# EAGLE schematic ControlModule (EAGLE 9.1.3)
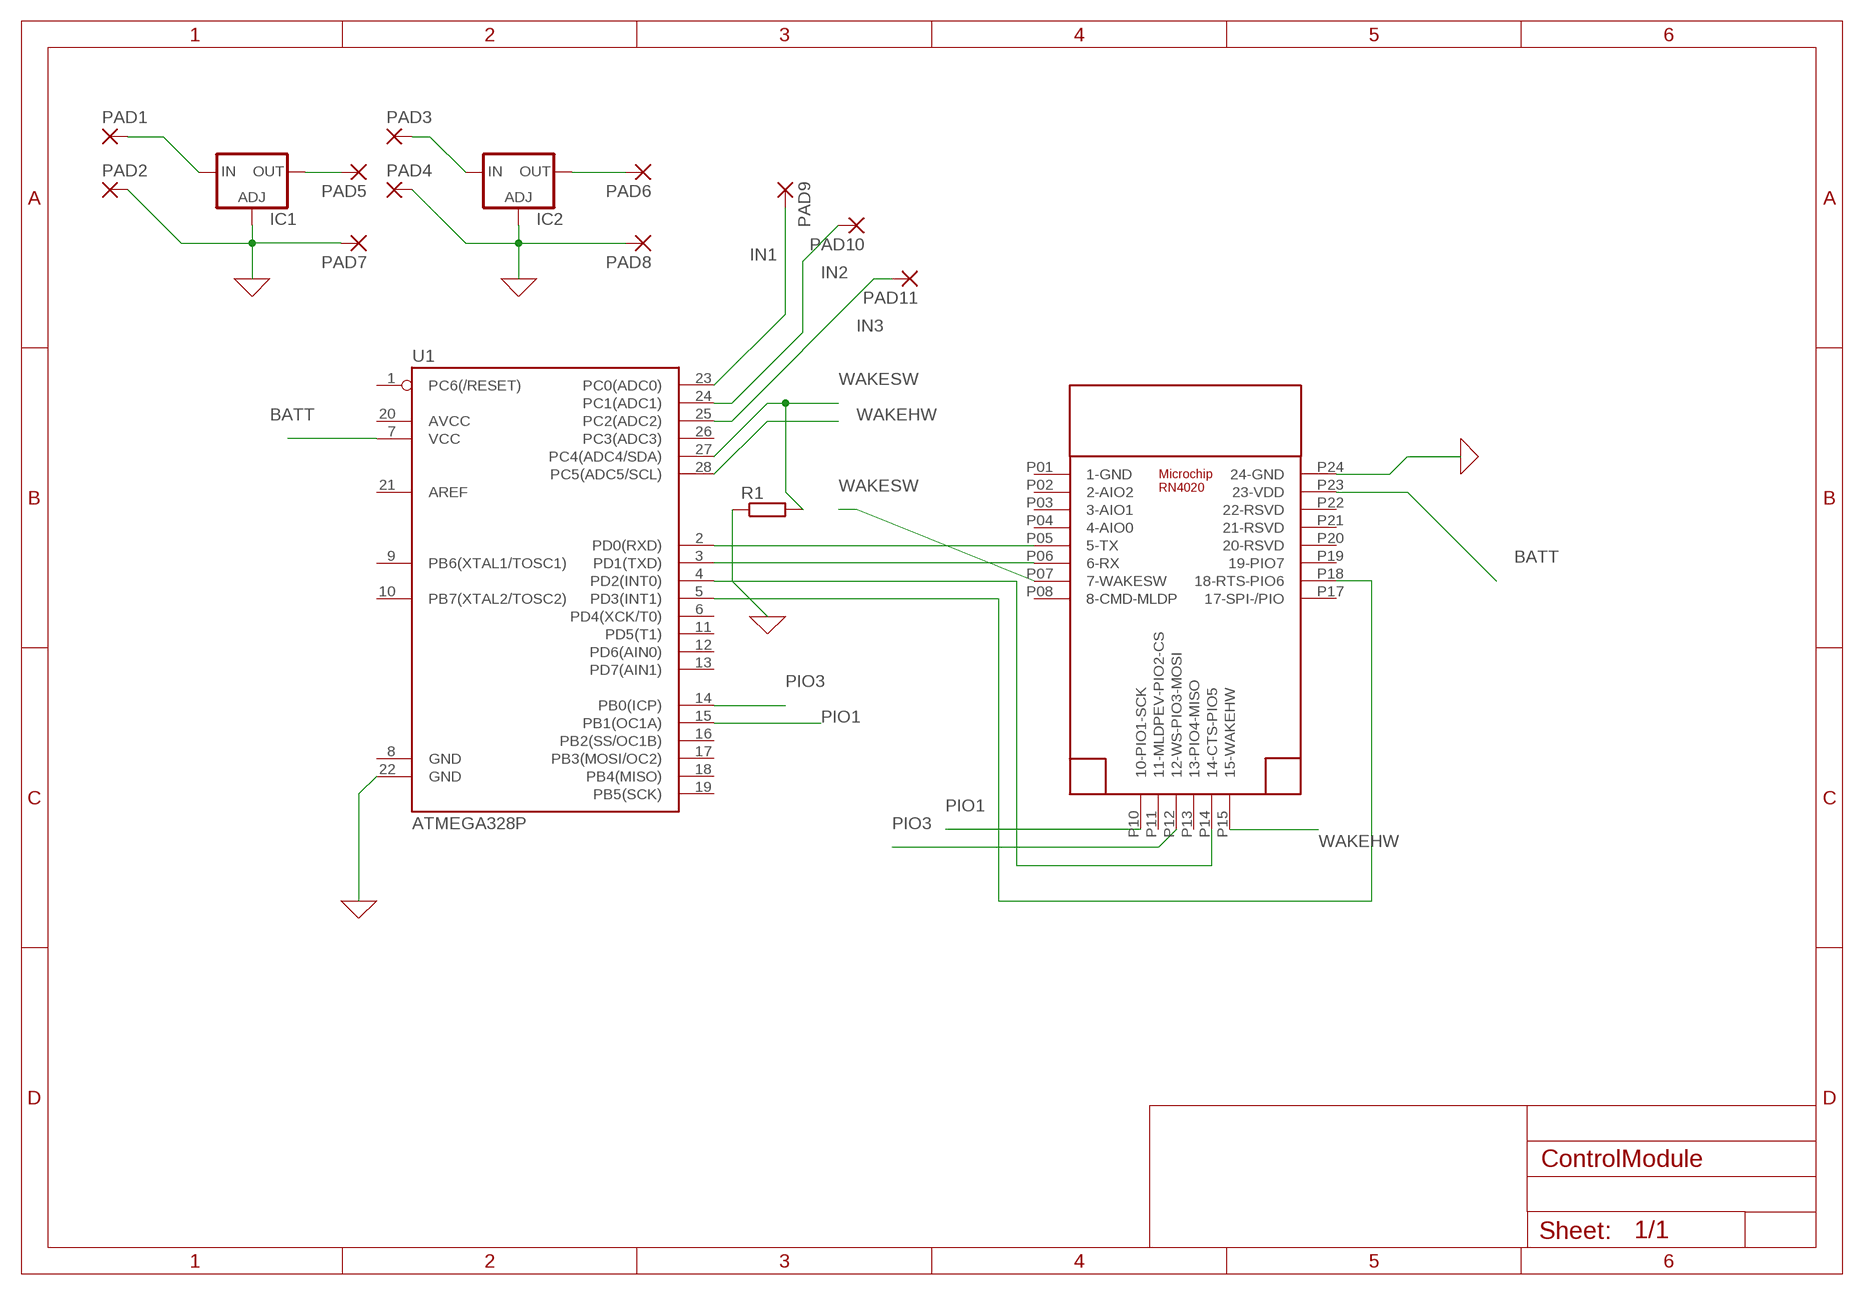
[diagram p0: schematic, sheet 1]

## Parts
IC1  LM138-TL  [TO220L1]
IC2  LM138-TL  [TO220L1]
PAD1  2,54/1,1  [2,54/1,1]
PAD2  2,54/1,1  [2,54/1,1]
PAD3  2,54/1,1  [2,54/1,1]
PAD4  2,54/1,1  [2,54/1,1]
PAD5  2,54/1,1  [2,54/1,1]
PAD6  2,54/1,1  [2,54/1,1]
PAD7  2,54/1,1  [2,54/1,1]
PAD8  2,54/1,1  [2,54/1,1]
PAD9  2,54/1,1  [2,54/1,1]
PAD10  2,54/1,1  [2,54/1,1]
PAD11  2,54/1,1  [2,54/1,1]
R1  R-EU_R0805  [R0805]
U1  ATMEGA328P  ATMEGA328P_PDIP  [DIP28]
U$1  RN4020  [RN4020SMD]

## Nets
0: IC1.1(ADJ) IC2.1(ADJ) PAD2.1(P) PAD4.1(P) PAD7.1(P) PAD8.1(P) R1.1 U1.22(GND) U$1.P24(24-GND) ; supply symbol labelled GND
BATT: U1.7(VCC) U$1.P23(23-VDD)
IN1: PAD9.1(P) U1.23(PC0(ADC0))
IN2: PAD10.1(P) U1.24(PC1(ADC1))
IN3: PAD11.1(P) U1.25(PC2(ADC2))
N$1: U1.3(PD1(TXD)) U$1.P06(6-RX)
N$2: U1.2(PD0(RXD)) U$1.P05(5-TX)
N$3: U1.4(PD2(INT0)) U$1.P14(14-CTS-PIO5)
N$4: U1.5(PD3(INT1)) U$1.P18(18-RTS-PIO6)
N$5: IC1.3(IN) PAD1.1(P)
N$6: IC2.3(IN) PAD3.1(P)
N$7: IC1.2(OUT) PAD5.1(P)
N$9: IC2.2(OUT) PAD6.1(P)
PIO1: U1.15(PB1(OC1A)) U$1.P10(10-PIO1-SCK)
PIO3: U1.14(PB0(ICP)) U$1.P12(12-WS-PIO3-MOSI)
WAKEHW: U1.28(PC5(ADC5/SCL)) U$1.P15(15-WAKEHW)
WAKESW: R1.2 U1.27(PC4(ADC4/SDA)) U$1.P07(7-WAKESW)
Unconnected: U1.1(PC6(/RESET)) U1.6(PD4(XCK/T0)) U1.8(GND) U1.9(PB6(XTAL1/TOSC1)) U1.10(PB7(XTAL2/TOSC2)) U1.11(PD5(T1)) U1.12(PD6(AIN0)) U1.13(PD7(AIN1)) U1.16(PB2(SS/OC1B)) U1.17(PB3(MOSI/OC2)) U1.18(PB4(MISO)) U1.19(PB5(SCK)) U1.20(AVCC) U1.21(AREF) U1.26(PC3(ADC3)) U$1.P01(1-GND) U$1.P02(2-AIO2) U$1.P03(3-AIO1) U$1.P04(4-AIO0) U$1.P08(8-CMD-MLDP) U$1.P11(11-MLDPEV-PIO2-CS) U$1.P13(13-PIO4-MISO) U$1.P17(17-SPI-/PIO) U$1.P19(19-PIO7) U$1.P20(20-RSVD) U$1.P21(21-RSVD) U$1.P22(22-RSVD)

## Library data of the parts
IC1 IC2 = v-reg:LM138-TL: VOLTAGE REGULATOR
PAD1-PAD11 = wirepad:2,54/1,1: THROUGH-HOLE PAD
R1 = rcl:R-EU_: RESISTOR, European symbol; SPICEPREFIX: R
U1 = SparkFun-IC-Microcontroller:ATMEGA328P_PDIP: Atmel 328P Through hole ATMEGA328P uC used in the Arduino 32kb flash, 1k EEPROM, 2k SRAM Datasheet <http://www.sparkfun.com/datasheets/Components/SMD/ATMega328.pdf> SparkFun Products Storefront component: AVR 28 Pin 20MHz 32K 6A/D - ATMega328P <https://www.sparkfun.com/products/9061> (COM-09061) SparkFun Simon Says - Through-Hole Soldering Kit <https://www.sparkfun.com/products/10547> (KIT-10547) SparkFun Learn to Solder - Simon Says <https://www.sparkfun.com/products/13708> (KIT-13708) SparkFun BigTime Watch Kit <https://www.sparkfun.com/products/11734> (KIT-11734) SparkFun ClockIt <https://www.sparkfun.com/products/10930> (KIT-10930) SparkFun Serial Enabled LCD Kit <https://www.sparkfun.com/products/10097> (LCD-10097) SparkFun Simon Tilts - Through Hole Soldering Kit <https://www.sparkfun.com/products/12634> (KIT-12634) SparkFun Frequency Counter Kit <https://www.sparkfun.com/products/10140> (KIT-10140) FabFM Radio Kit <https://www.sparkfun.com/products/11043> (KIT-11043) SparkFun Binary Blaster Kit <https://www.sparkfun.com/products/12037> (KIT-12037) SparkFun Metro-Gnome <https://www.sparkfun.com/products/9236> (KIT-09236) ATmega328 with Arduino Optiboot (Uno) <https://www.sparkfun.com/products/10524> (DEV-10524); PROD_ID: IC-09136; VALUE: 328P
U$1 = microchip_bluetooth_v101:RN4020